# Altium schematic sheet USB.SchDoc
size A; SheetNumber: 3; SheetTotal: 31
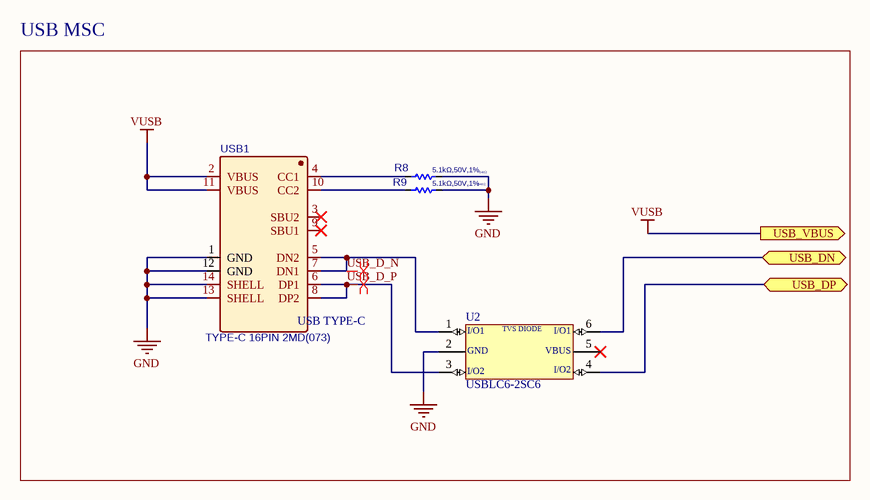
[diagram p0: USB.SchDoc]

## Parts
R8  value 5.1kΩ,50V,1%  Package: 0402  [R0402]  (hidden comment: 5.1KΩ)
R9  value 5.1kΩ,50V,1%  Package: 0402  [R0402]  (hidden comment: 5.1KΩ)
U2  USBLC6-2SC6  [SOT95P280X145-6N]
USB1  TYPE-C 16PIN 2MD(073)  [TYPE-C 16PIN 2MD(073)]

## Blocks framed on the sheet
USB MSC: R8 R9 U2 USB1

## Ports
USB_DN (bidir), USB_DP (bidir), USB_VBUS (out)

## Nets
GND: R8.2 R9.2 U2.2(GND) USB1.1(GND) USB1.12(GND) USB1.13(SHELL) USB1.14(SHELL)
VUSB: USB1.2(VBUS) USB1.11(VBUS) ; port USB_VBUS
USB_D_N: U2.1(I/O1_IN) USB1.5(DN2) USB1.7(DN1)
USB_D_P: U2.3(I/O2_IN) USB1.6(DP1) USB1.8(DP2)
USB_DN: U2.6(I/O1_OUT) ; port USB_DN
USB_DP: U2.4(I/O2_OUT) ; port USB_DP
NetR8_1: R8.1 USB1.4(CC1)
NetR9_1: R9.1 USB1.10(CC2)

Not connected (* = marked no-connect by the designer): U2 5(VBUS)*; USB1 3(SBU2)* 9(SBU1)*

## Layout directives
differential pair; net class USB: USB_D_N, USB_D_P

## Notes on the sheet
- (in symbol TYPE-C 16PIN 2MD(073)) USB TYPE-C
- (in symbol USBLC6-2SC6) I/O1; TVS DIODE; I/O2

## Library data of the parts
R8 R9 = RC0402FR-075K1L: 100mW Thick Film Resistors 75V ±100ppm/℃ ±1% 100kΩ 0603 Chip Resistor - Surface Mount ROHS; Manufacturer: YAGEO; Max Operating Temp: +155; MPN: RC0402FR-075K1L; Type: *; Datasheet: https://datasheet.lcsc.com/lcsc/2304140030_YAGEO-RC0402FR-075K1L_C105872.pdf; Min Operating Temp: -55; LCSC: C105872
U2 = USBLC6-2SC6: 17V Clamp 5A (8/20Âµs) Ipp Tvs Diode Surface Mount SOT-23-6; MF: STMicroelectronics; Value: *; Package: SOT-23-6 STMicroelectronics; MP: USBLC6-2SC6
USB1 = TYPE-C 16PIN 2MD(073): 5A 1 Surface Mount 16P Female -25℃~+85℃ Type-C SMD USB Connectors ROHS; Manufacturer: SHOU HAN(首韩); LCSC: C2765186; Package Reference: TYPE-C 16PIN 2MD(073)